# EAGLE design kaimat (EAGLE 9.3.0)
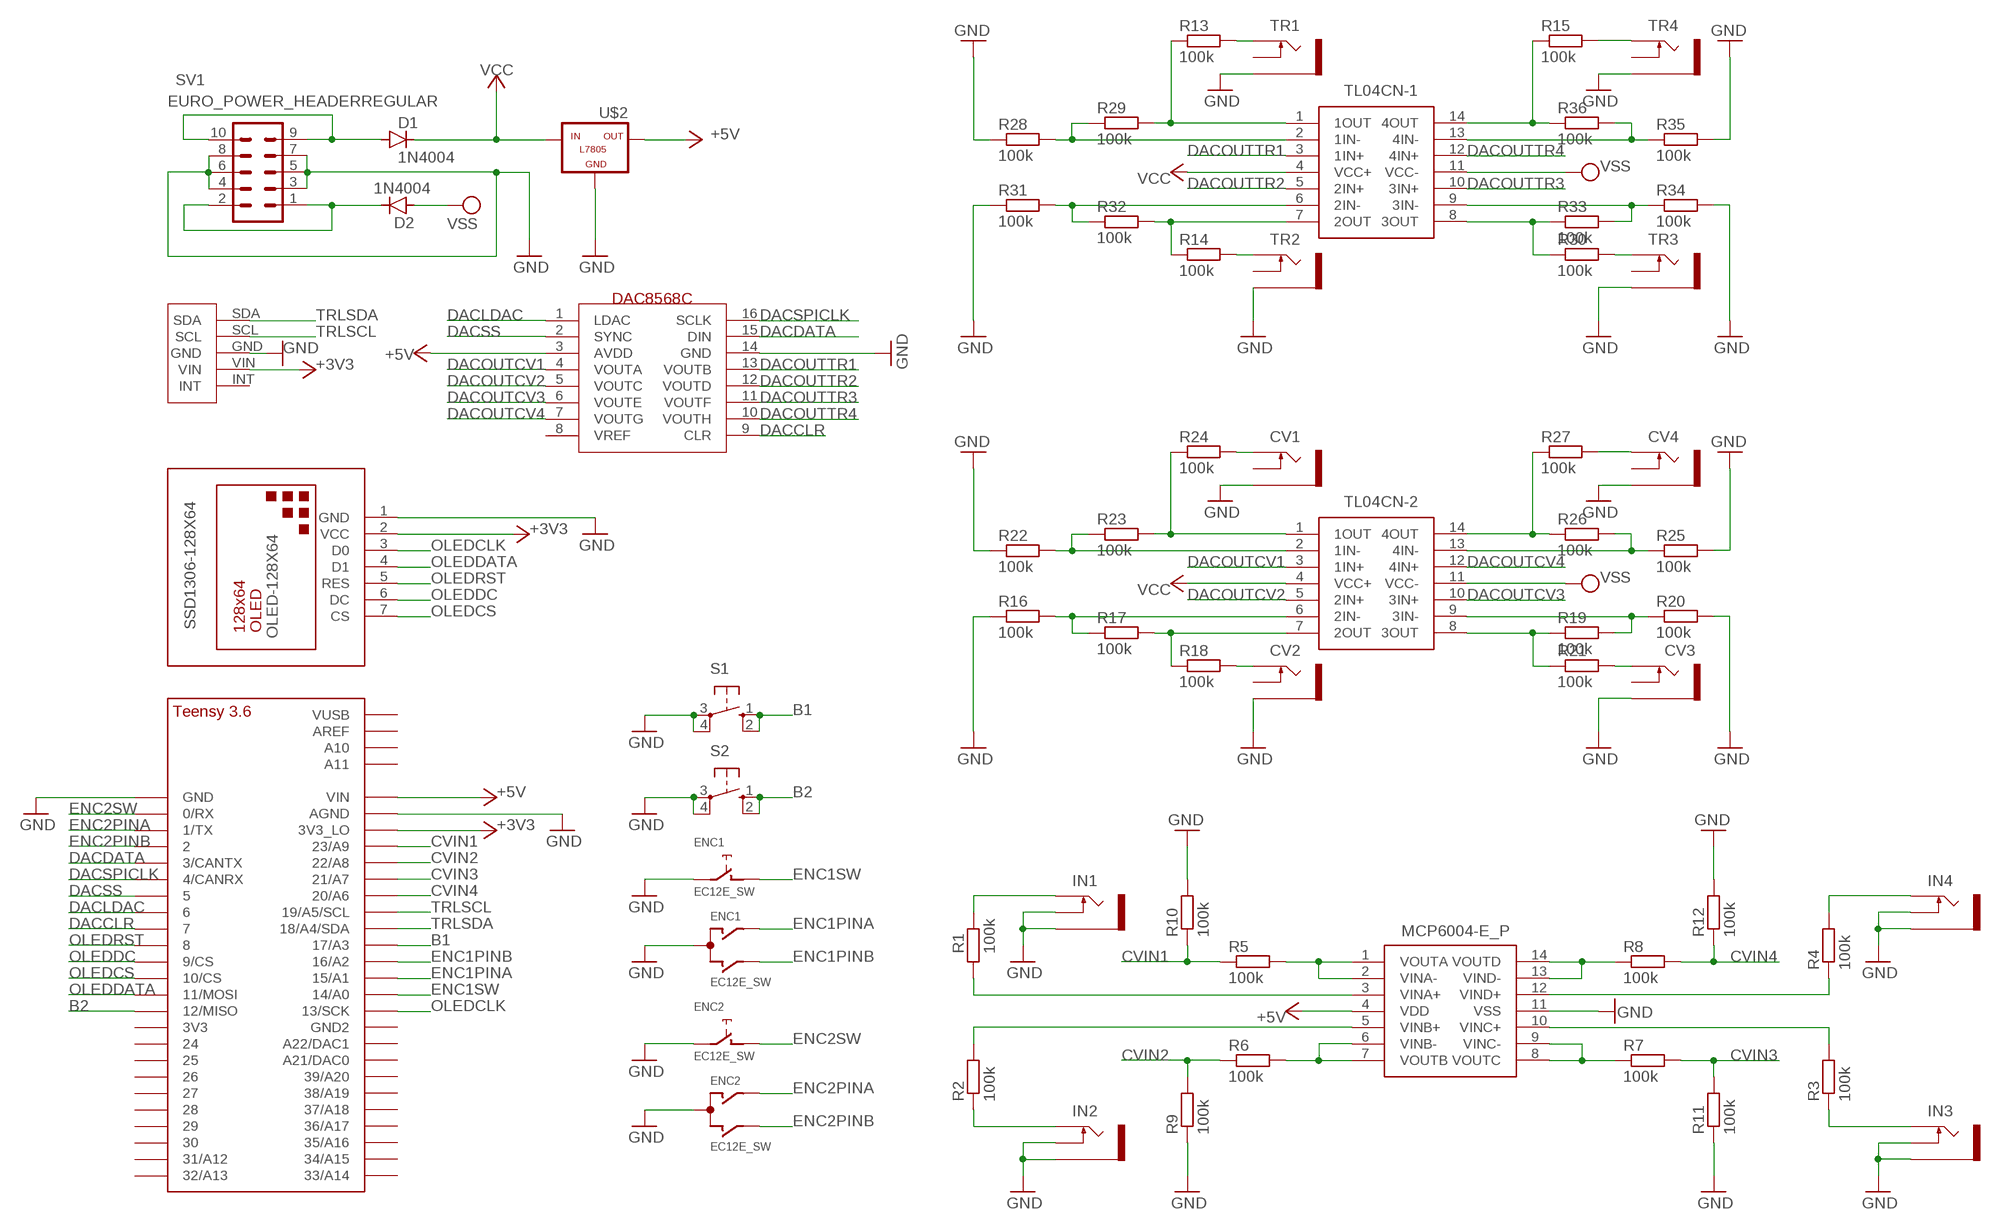
[diagram p0: schematic, sheet 1]

## Parts
CV1  THONKICONNNEW  [WQP-PJ301M-12_JACK]
CV2  THONKICONNNEW  [WQP-PJ301M-12_JACK]
CV3  THONKICONNNEW  [WQP-PJ301M-12_JACK]
CV4  THONKICONNNEW  [WQP-PJ301M-12_JACK]
D1  1N4004  [DO41-10]
D2  1N4004  [DO41-10]
DAC8568C  DAC8568C  [TSSOP16]
ENC1  EC12E_SW  [ALPS_EC12E_SW]
ENC2  EC12E_SW  [ALPS_EC12E_SW]
IN1  THONKICONNNEW  [WQP-PJ301M-12_JACK]
IN2  THONKICONNNEW  [WQP-PJ301M-12_JACK]
IN3  THONKICONNNEW  [WQP-PJ301M-12_JACK]
IN4  THONKICONNNEW  [WQP-PJ301M-12_JACK]
MCP6004-E_P  MCP6004-E_P  [DIP781W56P254L1918H533Q14N]
R1  100k  R-EU_R0805  [R0805]
R2  100k  R-EU_R0805  [R0805]
R3  100k  R-EU_R0805  [R0805]
R4  100k  R-EU_R0805  [R0805]
R5  100k  R-EU_R0805  [R0805]
R6  100k  R-EU_R0805  [R0805]
R7  100k  R-EU_R0805  [R0805]
R8  100k  R-EU_R0805  [R0805]
R9  100k  R-EU_R0805  [R0805]
R10  100k  R-EU_R0805  [R0805]
R11  100k  R-EU_R0805  [R0805]
R12  100k  R-EU_R0805  [R0805]
R13  100k  R-EU_R0805  [R0805]
R14  100k  R-EU_R0805  [R0805]
R15  100k  R-EU_R0805  [R0805]
R16  100k  R-EU_R0805  [R0805]
R17  100k  R-EU_R0805  [R0805]
R18  100k  R-EU_R0805  [R0805]
R19  100k  R-EU_R0805  [R0805]
R20  100k  R-EU_R0805  [R0805]
R21  100k  R-EU_R0805  [R0805]
R22  100k  R-EU_R0805  [R0805]
R23  100k  R-EU_R0805  [R0805]
R24  100k  R-EU_R0805  [R0805]
R25  100k  R-EU_R0805  [R0805]
R26  100k  R-EU_R0805  [R0805]
R27  100k  R-EU_R0805  [R0805]
R28  100k  R-EU_R0805  [R0805]
R29  100k  R-EU_R0805  [R0805]
R30  100k  R-EU_R0805  [R0805]
R31  100k  R-EU_R0805  [R0805]
R32  100k  R-EU_R0805  [R0805]
R33  100k  R-EU_R0805  [R0805]
R34  100k  R-EU_R0805  [R0805]
R35  100k  R-EU_R0805  [R0805]
R36  100k  R-EU_R0805  [R0805]
S1  10-XX  [B3F-10XX]
S2  10-XX  [B3F-10XX]
SSD1306-128X64  OLED-128X64  [DISPLAY-OLED-128X64-SMALL]
SV1  EURO_POWER_HEADERREGULAR  [EURO_POWER_HEADER]
TL04CN-1  TL074CN  [DIP794W53P254L1930H508Q14N]
TL04CN-2  TL074CN  [DIP794W53P254L1930H508Q14N]
TR1  THONKICONNNEW  [WQP-PJ301M-12_JACK]
TR2  THONKICONNNEW  [WQP-PJ301M-12_JACK]
TR3  THONKICONNNEW  [WQP-PJ301M-12_JACK]
TR4  THONKICONNNEW  [WQP-PJ301M-12_JACK]
U$1  TEENSY_3.5/3.6_BASIC  [TEENSY_3.5/3.6_BASIC]
U$2  -L7805  [L7805]
U$4  NEOTRELLISKAIMAT2  [NEOTRELLISKAIMAT2]

## Nets
+3V3: SSD1306-128X64.2(VCC) U$1.3V3_LO U$4.VIN
+5V: DAC8568C.3(AVDD) MCP6004-E_P.4(VDD) U$1.VIN U$2.OUT
B1: S1.1(S) S1.2(S1) U$1.17/A3
B2: S2.1(S) S2.2(S1) U$1.12/MISO
CVIN1: R5.1 R10.1 U$1.23/A9
CVIN2: R6.1 R9.2 U$1.22/A8
CVIN3: R7.2 R11.2 U$1.21/A7
CVIN4: R8.2 R12.1 U$1.20/A6
DACCLR: DAC8568C.9(CLR) U$1.7
DACDATA: DAC8568C.15(DIN) U$1.3/CANTX
DACLDAC: DAC8568C.1(LDAC) U$1.6
DACOUTCV1: DAC8568C.4(VOUTA) TL04CN-2.3(1IN+)
DACOUTCV2: DAC8568C.5(VOUTC) TL04CN-2.5(2IN+)
DACOUTCV3: DAC8568C.6(VOUTE) TL04CN-2.10(3IN+)
DACOUTCV4: DAC8568C.7(VOUTG) TL04CN-2.12(4IN+)
DACOUTTR1: DAC8568C.13(VOUTB) TL04CN-1.3(1IN+)
DACOUTTR2: DAC8568C.12(VOUTD) TL04CN-1.5(2IN+)
DACOUTTR3: DAC8568C.11(VOUTF) TL04CN-1.10(3IN+)
DACOUTTR4: DAC8568C.10(VOUTH) TL04CN-1.12(4IN+)
DACSPICLK: DAC8568C.16(SCLK) U$1.4/CANRX
DACSS: DAC8568C.2(SYNC) U$1.5
ENC1PINA: ENC1.A U$1.15/A1
ENC1PINB: ENC1.B U$1.16/A2
ENC1SW: ENC1.D U$1.14/A0
ENC2PINA: ENC2.A U$1.1/TX
ENC2PINB: ENC2.B U$1.2
ENC2SW: ENC2.D U$1.0/RX
GND: CV1.P$3_SLEEVE(SLEEVE) CV2.P$3_SLEEVE(SLEEVE) CV3.P$3_SLEEVE(SLEEVE) CV4.P$3_SLEEVE(SLEEVE) DAC8568C.14(GND) ENC1.C ENC1.E ENC2.C ENC2.E IN1.P$2_SWITCH(SWITCH) IN1.P$3_SLEEVE(SLEEVE) IN2.P$2_SWITCH(SWITCH) IN2.P$3_SLEEVE(SLEEVE) IN3.P$2_SWITCH(SWITCH) IN3.P$3_SLEEVE(SLEEVE) IN4.P$2_SWITCH(SWITCH) IN4.P$3_SLEEVE(SLEEVE) MCP6004-E_P.11(VSS) R9.1 R10.2 R11.1 R12.2 R16.1 R20.2 R22.1 R25.2 R28.1 R31.1 R34.2 R35.2 S1.3(P) S1.4(P1) S2.3(P) S2.4(P1) SSD1306-128X64.1(GND) SV1.3 SV1.4 SV1.5 SV1.6 SV1.7 SV1.8 TR1.P$3_SLEEVE(SLEEVE) TR2.P$3_SLEEVE(SLEEVE) TR3.P$3_SLEEVE(SLEEVE) TR4.P$3_SLEEVE(SLEEVE) U$1.AGND U$1.GND U$2.GND U$4.GND
N$1: D1.A SV1.9 SV1.10
N$2: R17.2 R18.1 TL04CN-2.7(2OUT)
N$3: IN1.P$1_TIP(TIP) R1.2
N$4: MCP6004-E_P.6(VINB-) MCP6004-E_P.7(VOUTB) R6.2
N$5: IN2.P$1_TIP(TIP) R2.1
N$6: IN3.P$1_TIP(TIP) R3.1
N$7: R14.1 R32.2 TL04CN-1.7(2OUT)
N$9: IN4.P$1_TIP(TIP) R4.2
N$11: MCP6004-E_P.5(VINB+) R2.2
N$12: MCP6004-E_P.13(VIND-) MCP6004-E_P.14(VOUTD) R8.1
N$13: MCP6004-E_P.8(VOUTC) MCP6004-E_P.9(VINC-) R7.1
N$14: MCP6004-E_P.3(VINA+) R1.1
N$15: MCP6004-E_P.10(VINC+) R3.2
N$16: MCP6004-E_P.12(VIND+) R4.1
N$17: R16.2 R17.1 TL04CN-2.6(2IN-)
N$18: MCP6004-E_P.1(VOUTA) MCP6004-E_P.2(VINA-) R5.2
N$19: CV2.P$1_TIP(TIP) R18.2
N$20: CV3.P$1_TIP(TIP) R21.2
N$21: R19.1 R21.1 TL04CN-2.8(3OUT)
N$22: R19.2 R20.1 TL04CN-2.9(3IN-)
N$23: R22.2 R23.1 TL04CN-2.2(1IN-)
N$24: R23.2 R24.1 TL04CN-2.1(1OUT)
N$25: CV1.P$1_TIP(TIP) R24.2
N$26: R25.1 R26.2 TL04CN-2.13(4IN-)
N$27: R26.1 R27.1 TL04CN-2.14(4OUT)
N$28: CV4.P$1_TIP(TIP) R27.2
N$29: D2.C SV1.1 SV1.2
N$30: R28.2 R29.1 TL04CN-1.2(1IN-)
N$31: R13.1 R29.2 TL04CN-1.1(1OUT)
N$32: R31.2 R32.1 TL04CN-1.6(2IN-)
N$33: R13.2 TR1.P$1_TIP(TIP)
N$34: R14.2 TR2.P$1_TIP(TIP)
N$35: R33.2 R34.1 TL04CN-1.9(3IN-)
N$36: R30.2 TR3.P$1_TIP(TIP)
N$37: R30.1 R33.1 TL04CN-1.8(3OUT)
N$38: R35.1 R36.2 TL04CN-1.13(4IN-)
N$39: R15.1 R36.1 TL04CN-1.14(4OUT)
N$40: R15.2 TR4.P$1_TIP(TIP)
OLEDCLK: SSD1306-128X64.3(D0) U$1.13/SCK
OLEDCS: SSD1306-128X64.7(CS) U$1.10/CS
OLEDDATA: SSD1306-128X64.4(D1) U$1.11/MOSI
OLEDDC: SSD1306-128X64.6(DC) U$1.9/CS
OLEDRST: SSD1306-128X64.5(RES) U$1.8
TRLSCL: U$1.19/A5/SCL U$4.SCL
TRLSDA: U$1.18/A4/SDA U$4.SDA
VCC: D1.C TL04CN-1.4(VCC+) TL04CN-2.4(VCC+) U$2.IN
VSS: D2.A TL04CN-1.11(VCC-) TL04CN-2.11(VCC-)
Unconnected: CV1.P$2_SWITCH(SWITCH) CV2.P$2_SWITCH(SWITCH) CV3.P$2_SWITCH(SWITCH) CV4.P$2_SWITCH(SWITCH) DAC8568C.8(VREF) ENC1.GND1(G) ENC1.GND2(G) ENC2.GND1(G) ENC2.GND2(G) TR1.P$2_SWITCH(SWITCH) TR2.P$2_SWITCH(SWITCH) TR3.P$2_SWITCH(SWITCH) TR4.P$2_SWITCH(SWITCH) U$1.3V3 U$1.21/DAC0(A21/DAC0) U$1.24 U$1.25 U$1.26 U$1.27 U$1.28 U$1.29 U$1.30 U$1.31/A12 U$1.32/A13 U$1.33/A14 U$1.34/A15 U$1.35/A16 U$1.36/A17 U$1.37/A18 U$1.38/A19 U$1.39/A20 U$1.A10 U$1.A11 U$1.A22/DAC1 U$1.AREF U$1.GND2 U$1.VUSB U$4.INT

## Library data of the parts
CV1-CV4 IN1-IN4 TR1-TR4 = MusicThingModular:THONKICONN: 3.5mm socket for Eurorack modular synths
D1 D2 = diode:1N4004: DIODE general purpose rectifier, 1 A
DAC8568C = analog-devices-3:DAC8568C
ENC1 ENC2 = switch-alps:EC12E_SW: ALPS rotary Encoder EC12E series with switch; MPN: EC12E2424407; OC_FARNELL: 1520813; OC_NEWARK: 74M1068
MCP6004-E_P = mcp6004-e_p:MCP6004-E_P: Microchip MCP6004-E/P Op Amp, 1MHz, 1.8 6 V Rail-Rail 0.6V/s Linear, 14-pin PDIP Source: Datasheet <http://docs-asia.electrocomponents.com/webdocs/1381/0900766b81381145.pdf>; DESCRIPTION: Microchip MCP6004-E/P Op Amp, 1MHz, 1.8 6 V Rail-Rail 0.6V/s Linear, 14-pin PDIP; HEIGHT: 5.334mm; MANUFACTURER_NAME: Microchip; MANUFACTURER_PART_NUMBER: mcp6004-e/p; MOUSER_PART_NUMBER: 579-MCP6004-E/P; MOUSER_PRICE-STOCK: https://www.mouser.com/Search/Refine.aspx?Keyword=579-MCP6004-E%2FP; RS_PART_NUMBER: 7386178P; RS_PRICE-STOCK: http://uk.rs-online.com/web/p/products/7386178P
R1-R36 = Clean-Kong:R-EU_: RESISTOR, European symbol
S1 S2 = switch-omron:10-XX: OMRON SWITCH; MPN: B3F-1000; OC_FARNELL: 176432; OC_NEWARK: 36M3542
SSD1306-128X64 = diy-modules:OLED-128X64
SV1 = MusicThingModular:EURO_POWER_HEADER: Power Header 10 pin power header for Eurorack Power Supplies Variants with fatter pads for easier soldering, and the LOCK variant which has 5mil offset pins to hold the component in place before soldering
TL04CN-1 TL04CN-2 = TL074CN:TL074CN: Quad Low-Noise JFET-Input General-Purpose Operational Amplifier Source: Datasheet <http://uk.rs-online.com/web/p/products/0302621>; DESCRIPTION: Quad Low-Noise JFET-Input General-Purpose Operational Amplifier; HEIGHT: 5.08mm; MANUFACTURER_NAME: Texas Instruments; MANUFACTURER_PART_NUMBER: TL074CN; MOUSER_PART_NUMBER: 595-TL074CN; MOUSER_PRICE-STOCK: https://www.mouser.com/Search/Refine.aspx?Keyword=595-TL074CN; RS_PART_NUMBER: 0302621P; RS_PRICE-STOCK: http://uk.rs-online.com/web/p/products/0302621P
U$1 = Teensy356:TEENSY_3.5/3.6_BASIC; OC_FARNELL: unknown
U$2 = tango:-L7805
U$4 = Adafruit Trellis:NEOTRELLISKAIMAT2

## Net classes
1 power: width 0.406 mm

## Board
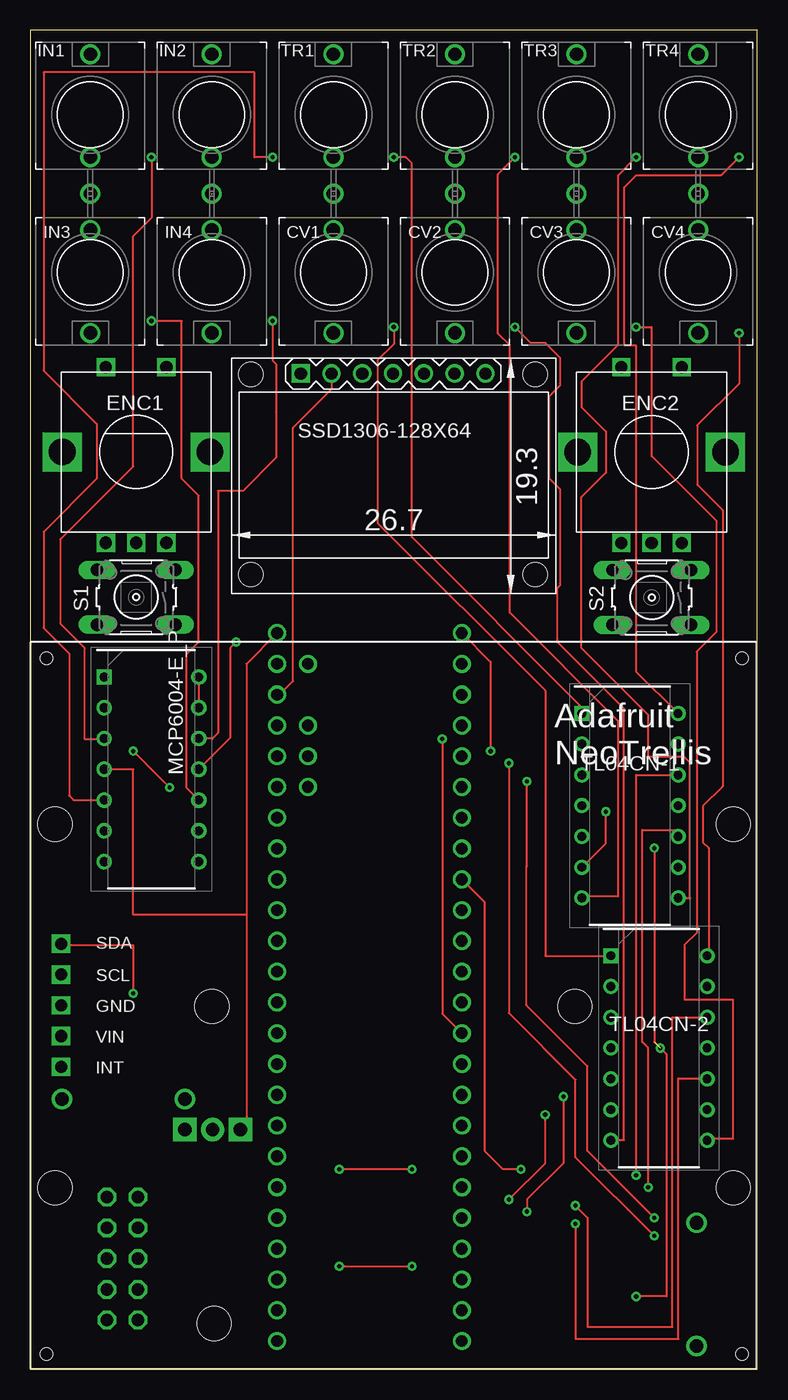
[diagram p1: board, top side]
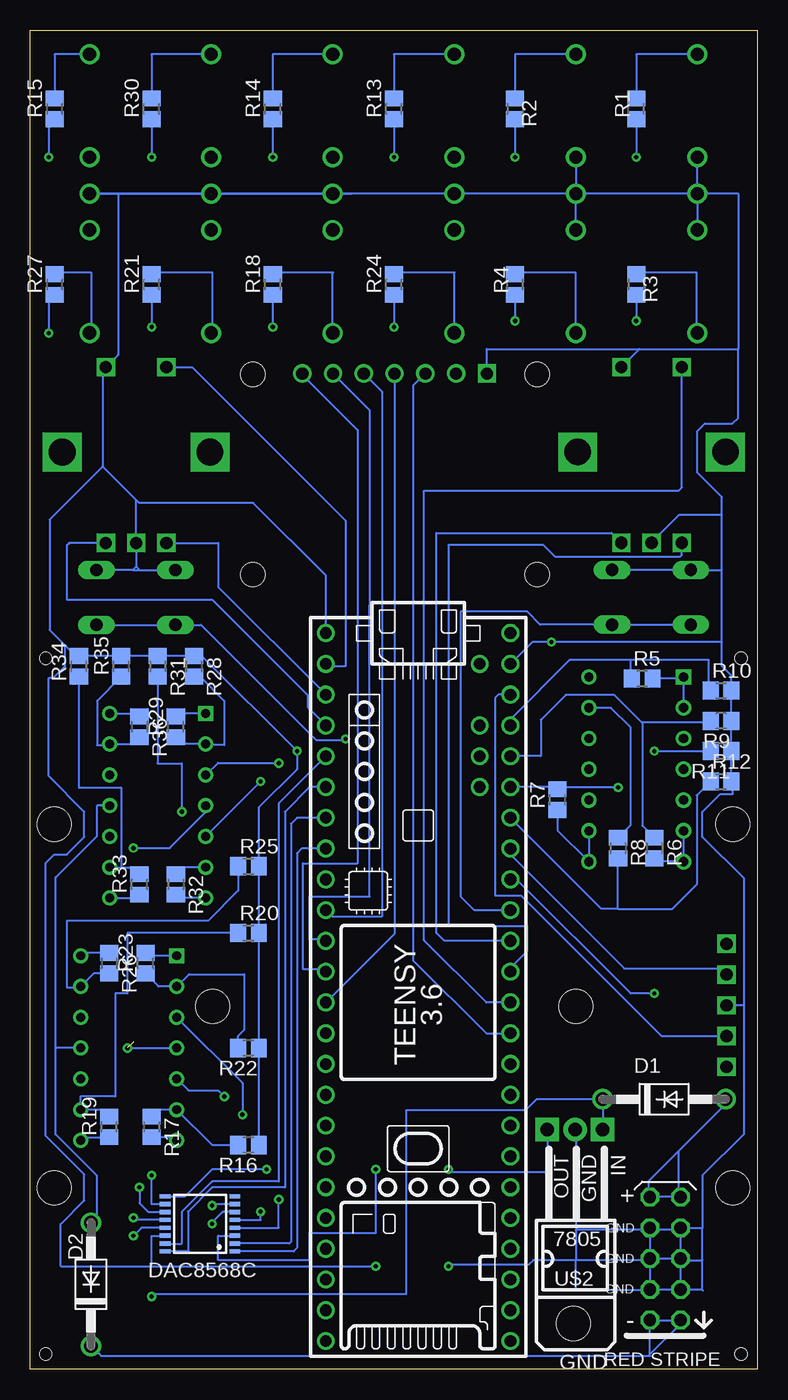
[diagram p2: board, bottom side, seen from below]

Size 60.01 x 110.48 mm. Coordinates in mm from the lower left corner, seen from the top.
Outline: 0,0 60.01,0 60.01,110.48 0,110.48 0,0
Copper layers (1*16): Top 0.035mm / dielectric 1.5mm / Bottom 0.035mm
Design rules "default": minimum track width 6mil, minimum drill 0.35mm, track to track 6mil, track to pad 6mil, pad to pad 6mil, via to via 6mil, smd to smd 6mil, copper to edge 40mil, drill to drill 6mil, minimum pad ring 10mil, minimum via ring 8mil, stop-mask expansion 4mil, vias tented up to drill 0mil, thermal gap 10mil

### Footprints (pad centres in the part's own frame; a part is rotated, then mirrored left to right if it is on the bottom)
WQP-PJ301M-12_JACK = drill 1.1: P$1_TIP 0,5; P$2_SWITCH 0,-3.5; P$3_SLEEVE 0,-6.5
DO41-10 = drill 1.118: A 5.08,0; C -5.08,0
TSSOP16 = smd 0.9 x 0.35: 1 -2.875,2.275; 2 -2.875,1.625; 3 -2.875,0.975; 4 -2.875,0.325; 5 -2.875,-0.325; 6 -2.875,-0.975; 7 -2.875,-1.625; 8 -2.875,-2.275; 9 2.875,-2.275; 10 2.875,-1.625; 11 2.875,-0.975; 12 2.875,-0.325; 13 2.875,0.325; 14 2.875,0.975; 15 2.875,1.625; 16 2.875,2.275
ALPS_EC12E_SW = drill 1 square: A -2.5,-7.5; B 2.5,-7.5; C 0,-7.5; D -2.5,7; E 2.5,7 | drill 2.2 square: GND1 -6.1,0; GND2 6.1,0
DIP781W56P254L1918H533Q14N = drill 0.759 pad 1.159 square: 1 -3.905,7.62 | drill 0.759 pad 1.159: 2 -3.905,5.08; 3 -3.905,2.54; 4 -3.905,0; 5 -3.905,-2.54; 6 -3.905,-5.08; 7 -3.905,-7.62; 8 3.905,-7.62; 9 3.905,-5.08; 10 3.905,-2.54; 11 3.905,0; 12 3.905,2.54; 13 3.905,5.08; 14 3.905,7.62
R0805 = smd 1.3 x 1.5: 1 -0.85,0; 2 0.85,0
B3F-10XX = drill 1.016 long: 1 -3.251,2.261; 2 3.251,2.261; 3 -3.251,-2.261; 4 3.251,-2.261
DISPLAY-OLED-128X64-SMALL = drill 1 square: 1 -6.985,7.62 | drill 1: 2 -4.445,7.62; 3 -1.905,7.62; 4 0.635,7.62; 5 3.175,7.62; 6 5.715,7.62; 7 8.255,7.62 | hole 2: -11.125,7.54; 12.351,7.54; 12.351,-8.97; -11.125,-8.97
EURO_POWER_HEADER = drill 1.016 octagon: 1 -5.08,-1.27; 2 -5.08,1.27; 3 -2.54,-1.27; 4 -2.54,1.27; 5 0,-1.27; 6 0,1.27; 7 2.54,-1.27; 8 2.54,1.27; 9 5.08,-1.27; 10 5.08,1.27
DIP794W53P254L1930H508Q14N = drill 0.73 pad 1.13 square: 1 -3.97,7.62 | drill 0.73 pad 1.13: 2 -3.97,5.08; 3 -3.97,2.54; 4 -3.97,0; 5 -3.97,-2.54; 6 -3.97,-5.08; 7 -3.97,-7.62; 8 3.97,-7.62; 9 3.97,-5.08; 10 3.97,-2.54; 11 3.97,0; 12 3.97,2.54; 13 3.97,5.08; 14 3.97,7.62
TEENSY_3.5/3.6_BASIC = drill 0.965: 0/RX -25.4,-7.62; 1/TX -22.86,-7.62; 2 -20.32,-7.62; 3/CANTX -17.78,-7.62; 3V3 7.62,-7.62; 3V3_LO -22.86,7.62; 4/CANRX -15.24,-7.62; 5 -12.7,-7.62; 6 -10.16,-7.62; 7 -7.62,-7.62; 8 -5.08,-7.62; 9/CS -2.54,-7.62; 10/CS 0,-7.62; 11/MOSI 2.54,-7.62; 12/MISO 5.08,-7.62; 13/SCK 5.08,7.62; 14/A0 2.54,7.62; 15/A1 0,7.62; 16/A2 -2.54,7.62; 17/A3 -5.08,7.62; 18/A4/SDA -7.62,7.62; 19/A5/SCL -10.16,7.62; 20/A6 -12.7,7.62; 21/A7 -15.24,7.62; 21/DAC0 12.7,7.62; 22/A8 -17.78,7.62; 23/A9 -20.32,7.62; 24 10.16,-7.62; 25 12.7,-7.62; 26 15.24,-7.62; 27 17.78,-7.62; 28 20.32,-7.62; 29 22.86,-7.62; 30 25.4,-7.62; 31/A12 27.94,-7.62; 32/A13 30.48,-7.62; 33/A14 30.48,7.62; 34/A15 27.94,7.62; 35/A16 25.4,7.62; 36/A17 22.86,7.62; 37/A18 20.32,7.62; 38/A19 17.78,7.62; 39/A20 15.24,7.62; A10 -17.78,5.08; A11 -15.24,5.08; A22/DAC1 10.16,7.62; AGND -25.4,7.62; AREF -20.32,5.08; GND -27.94,-7.62; GND2 7.62,7.62; VIN -27.94,7.62; VUSB -25.4,5.08
L7805 = drill 1.1 pad 1.93: GND 0.127,-9.652 | drill 1.1 pad 1.93 square: IN -2.159,-9.652; OUT 2.413,-9.652 | hole 2.8: 0.254,6.35
NEOTRELLISKAIMAT2 = drill 1 square: GND 2.54,-29.972; INT 2.54,-35.052; SCL 2.54,-27.432; SDA 2.54,-24.892; VIN 2.54,-32.512 | hole 2.8: 2.035,-15.036; 58.035,-15.036; 2.035,-45.035; 58.035,-45.035; 14.989,-30.049; 44.962,-30.049 | hole 1: 1.335,-1.335; 58.736,-1.335; 1.335,-58.736; 58.736,-58.736

### Placement (x,y rotation side)
CV1  25.02,90.5 180 top
CV2  35.05,90.5 180 top
CV3  45.09,90.5 180 top
CV4  55.12,90.5 180 top
D1  7.69,22.27 0 bottom
D2  55,7 90 bottom
DAC8568C  46,12 180 bottom
ENC1  8.73,75.69 0 top
ENC2  51.28,75.68 0 top
IN1  4.95,103.5 0 top
IN2  14.99,103.5 0 top
IN3  4.95,90.5 180 top
IN4  14.99,90.5 180 top
MCP6004-E_P  10,49.5 0 top
R1  10,104 90 bottom
R2  20,104 270 bottom
R3  10,89.5 270 bottom
R4  20,89.5 90 bottom
R5  9.5,57 0 bottom
R6  8.5,43 270 bottom
R7  16.5,47 90 bottom
R8  11.5,43 270 bottom
R9  3,53.5 180 bottom
R10  3,56 0 bottom
R11  3,51 180 bottom
R12  3,48.5 0 bottom
R13  30,104 90 bottom
R14  40,104 90 bottom
R15  58,104 90 bottom
R16  42,18.5 180 bottom
R17  50,20 270 bottom
R18  40,89.5 90 bottom
R19  53.5,20 90 bottom
R20  42,36 0 bottom
R21  50,89.5 90 bottom
R22  42,26.5 180 bottom
R23  50.5,33.5 90 bottom
R24  30,89.5 90 bottom
R25  42,41.5 0 bottom
R26  53.5,33.5 270 bottom
R27  58,89.5 90 bottom
R28  46.5,58 270 bottom
R29  48,53 90 bottom
R30  50,104 90 bottom
R31  49.5,58 270 bottom
R32  48,40 270 bottom
R33  51,40 90 bottom
R34  56,58 90 bottom
R35  52.5,58 90 bottom
R36  51,53 270 bottom
S1  8.74,63.7 180 top
S2  51.29,63.68 180 top
SSD1306-128X64  29.31,74.54 0 top
SV1  7.6,9.12 90 bottom
TL04CN-1  49.5,46.5 0 top
TL04CN-2  51.89,26.5 0 top
TR1  25.02,103.5 0 top
TR2  35.05,103.5 0 top
TR3  45.09,103.5 0 top
TR4  55.12,103.5 0 top
U$1  28,32.8 270 bottom
U$2  14.93,10.12 180 bottom
U$4  0,60 0 top

### Tracks (layer width: path | path; a pad name or v marks a point on that pad's centre or on a via)
+3V3
  Top 0.152: SSD1306-128X64.2 24.86,80.86 21.69,77.69 21.69,56.78 20.57,55.66 U$1.3V3_LO
  Bottom 0.152: U$4.VIN 7.92,27.49 19.51,39.08 21.64,39.08 21.64,55.4 21.38,55.66 U$1.3V3_LO
+5V  (via drill 0.35)
  Top 0.152: 17.84,37.5 17.84,58.2 U$1.VIN | 17.84,37.5 17.84,20.27 U$2.OUT | v31.5,16.5 v25.5,16.5 | 17.84,37.5 8.5,37.5 8.5,49.5 MCP6004-E_P.4
  Bottom 0.152: U$2.OUT 17.34,16.3 25.3,16.3 v25.5,16.5 | v31.5,16.5 31.5,11.22 37,11.22 37,9 44.5,9 44.5,11.03 DAC8568C.3
B1
  Bottom 0.152: S1.2 S1.1 17.94,61.44 19,62.5 24.5,62.5 24.5,39 23.38,37.88 U$1.17/A3
B2  (via drill 0.35)
  Top 0.152: v34,52 34,29.34 U$1.12/MISO
  Bottom 0.152: S2.1 S2.2 45.92,61.42 36.41,51.91 34.09,51.91 v34,52
CVIN1
  Bottom 0.152: U$1.23/A9 20.38,53.62 15.5,58.5 10.5,58.5 | R10.1 4,56.15 4,58.5 10.5,58.5 | 10.5,58.5 10.5,57 R5.1
CVIN2
  Bottom 0.152: U$1.22/A8 17.88,50.58 17.88,53.58 15.82,55.63 11.81,55.63 9.59,53.41 | R6.1 9.5,44.85 9.5,53.33 9.59,53.41 | 9.59,53.41 3.94,53.41 R9.2
CVIN3  (via drill 0.35)
  Top 0.152: v8.5,51 v11.5,48
  Bottom 0.152: R7.2 16.32,47.67 16.07,47.92 | 16.07,47.92 16.19,48.04 U$1.21/A7 | v11.5,48 16,48 16.07,47.92 | v8.5,51 R11.2
CVIN4
  Bottom 0.152: R12.1 5,47.35 5,40 7,38 11.5,38 | 11.5,38 12.88,38 U$1.20/A6 | 11.5,38 R8.2
DACCLR  (via drill 0.35)
  Top 0.152: U$1.7 37.5,38.54 37.5,18 39,16.5 v40.5,16.5
  Bottom 0.152: DAC8568C.9 47.23,14.28 45,16.5 v40.5,16.5
DACDATA
  Bottom 0.152: U$1.3/CANTX 39.5,46.7 39.5,15.5 45,15.5 47.5,13 47.5,10.35 48.85,10.35 DAC8568C.15
DACLDAC
  Bottom 0.152: U$1.6 37.62,42.96 38,42.58 38,10 38.27,9.72 DAC8568C.1
DACOUTCV1  (via drill 0.35)
  Top 0.152: v39.5,14 42.5,17 v42.5,21
  Bottom 0.152: DAC8568C.4 39.5,11.68 v39.5,14 | v42.5,21 42.5,23.62 TL04CN-2.3
DACOUTCV2  (via drill 0.35)
  Top 0.152: v41,13 41,14 44,17 v44,22.5
  Bottom 0.152: DAC8568C.5 41,12.32 v41,13 | v44,22.5 44.5,23 46.96,23 TL04CN-2.5
DACOUTCV3  (via drill 0.35)
  Top 0.152: v45,12 45,2.5 53.5,2.5 53.5,24 55.82,24 TL04CN-2.10
  Bottom 0.152: DAC8568C.6 44.12,12.97 45,12.1 v45,12
DACOUTCV4  (via drill 0.35)
  Top 0.152: v45,13.5 46,12.5 46,3.5 53,3.5 53,29.04 TL04CN-2.12
  Bottom 0.152: DAC8568C.7 44.88,13.62 v45,13.5
DACOUTTR1  (via drill 0.35)
  Top 0.152: v51.5,11 45,17.5 45,23.89 39.5,29.39 v39.5,50
  Bottom 0.152: DAC8568C.13 50.83,11.68 v51.5,11 | v39.5,50 39.54,50.04 44.53,50.04 TL04CN-1.3
DACOUTTR2  (via drill 0.35)
  Top 0.152: v51.5,12.5 46,18 46,25 40.97,30.03 40.97,41.47 41,41.5 v41,48.5
  Bottom 0.152: DAC8568C.12 51.33,12.32 v51.5,12.5 | v41,48.5 v41,48.49 TL04CN-1.5
DACOUTTR3  (via drill 0.35)
  Top 0.152: v51,15 51,26.5 50.5,27 50.5,44.5 53.5,44.5 53.5,43.99 TL04CN-1.10
  Bottom 0.152: v51,15 v50.99,14.99 50.99,13.69 50.28,12.97 DAC8568C.11
DACOUTTR4  (via drill 0.35)
  Top 0.152: v50,16 50,49.04 TL04CN-1.12
  Bottom 0.152: DAC8568C.10 50,13.62 v50,16
DACSPICLK
  Bottom 0.152: U$1.4/CANRX 36.96,48.04 39,46 39,15 45,15 47,13 47,9.71 48.86,9.71 DAC8568C.16
DACSS
  Bottom 0.152: U$1.5 38,45.5 38.5,45 38.5,10.5 38.62,10.38 DAC8568C.2
ENC1PINA
  Bottom 0.152: U$1.15/A1 20.38,33.12 19,34.5 19,36.58 25.5,36.58 25.5,68 17.66,68 16.73,67.07 6.36,67.07 6.24,67.19 ENC1.A
ENC1PINB
  Bottom 0.152: U$1.16/A2 25.84,35.34 26.5,36 26.5,69 12.04,69 ENC1.B
ENC1SW
  Bottom 0.152: U$1.14/A0 22.38,30.26 27.5,35.38 27.5,72.5 6.5,72.5 6.24,72.77 ENC1.D
ENC2PINA
  Bottom 0.152: ENC2.A 44.5,68.18 44.5,64.55 U$1.1/TX
ENC2PINB
  Bottom 0.152: ENC2.B 56.82,68.18 57,68 57,63.5 45,63.5 37.12,55.62 37.12,54.63 U$1.2
ENC2SW
  Bottom 0.152: ENC2.D 46.64,82.68 34,70.04 34,58 35.41,58 U$1.0/RX
GND  (via drill 0.35)  (5 unrouted)
  Top 0.152: 35.36,61 U$1.GND 38,58.36 v38,51 | v25.5,8.5 v31.5,8.5 | MCP6004-E_P.11 16.5,52.09 16.5,59.5 v17,60
  Bottom 0.152: 8.87,11.5 SV1.8 9.04,11.5 | 8.87,11.5 8.87,9 | SV1.4 SV1.3 | SV1.3 SV1.7 | SV1.7 6.5,11.5 8.87,11.5 | SV1.7 4.53,11.66 | 1.09,30 1.09,19.43 4.53,16 4.53,11.66 | 1.09,30 2.51,30 U$4.GND | 1.09,30 1.09,40.5 4.53,43.93 4.53,46 3.07,47.46 2.04,47.46 | 2.04,47.46 2,47.5 | 2.93,60 2.93,58.01 2.15,57.23 R10.2 R9.1 R11.1 R12.2 2.04,48.39 2.04,47.46 | 2.93,60 2.93,66 | 2.93,66 2.93,70.5 | 2.93,70.5 2.93,71.94 4.97,73.99 4.97,77.39 4.34,78.03 2.06,78.03 1.59,78.5 1.59,84.17 | 1.59,84.17 1.59,97 5.5,97 | 5.5,97 IN1.P$3_SLEEVE | IN1.P$3_SLEEVE IN1.P$2_SWITCH | IN1.P$3_SLEEVE IN3.P$2_SWITCH | IN1.P$3_SLEEVE 14,97 IN4.P$3_SLEEVE | IN4.P$3_SLEEVE 33.51,97 | 35.5,97 TR3.P$3_SLEEVE 45.5,97 | 45.5,97 52.78,97 | 52.78,97 TR4.P$3_SLEEVE | TR4.P$3_SLEEVE | IN2.P$2_SWITCH IN4.P$3_SLEEVE | IN4.P$2_SWITCH 15,94.01 IN4.P$3_SLEEVE | 2.93,66 2.97,65.96 S1.4 S1.3 | S1.3 12,65.46 | U$2.GND 15,19.72 15,11.5 | 8.87,11.5 9.04,11.5 | 9.04,11.5 15,11.5 | 52.78,97 52.78,83.68 ENC2.E 54.04,82.42 54.04,74.5 | ENC2.C 51.28,66.22 51.56,65.94 | 51.56,65.94 S2.3 | 51.56,65.94 51,65.94 | 51,65.94 S2.4 | ENC2.C 51.28,66.22 51,65.94 | SSD1306-128X64.1 22.32,84.17 9.75,84.17 | 9.75,84.17 1.59,84.17 | ENC1.E 9.75,84.17 | ENC1.C 6.43,70.5 2.93,70.5 | 15,11.5 15,9 | 8.87,9 15,9 | 50,8.5 v31.5,8.5 | 50,8.5 50,11 48.9,11 DAC8568C.14 48.85,11 | R16.1 R22.1 R20.2 R25.2 41.15,46.35 38,49.5 v38,51 45.85,58.85 R28.1 R31.1 R35.2 R34.2 56.27,58.85 57.14,59.72 | 2.93,60 v17,60 18.58,60 U$1.AGND | 12.04,66 S1.3 | IN4.P$3_SLEEVE | TR1.P$3_SLEEVE 35.49,97 35.5,97 | TR2.P$3_SLEEVE 45.49,97 45.5,97 | 54.04,74.5 54.04,74.48 58.42,70.1 58.42,61 57.14,59.72 | 50,8.5 57.5,8.5 57.5,11.97 55.54,13.93 55.54,16.07 58.73,19.25 58.73,41.77 58.03,42.47 57,42.47 55.54,43.93 55.54,46 58.5,48.95 58.5,57 58.43,57.07 58.08,57.07 57.14,58.01 57.14,59.72
  Bottom 0.152: 8.87,9 8.75,9.12 SV1.5 6.21,9 4.53,9 | SV1.6 SV1.4 | SV1.4 8.96,6.5 15,6.5 15,9 | SV1.3 4.58,6.58 4.53,6.53 | 4.5,6.5 4.53,6.53 | 4.53,6.53 4.53,9 | 4.53,9 4.53,11.66 | ENC2.C 51.28,71.74 | 51.28,71.74 51.02,71.48 41.61,71.48 35.62,65.48 U$1.GND | 51.28,71.74 54.04,74.5 | TR4.P$3_SLEEVE | 15,9 18.5,9 18.85,8.65 25.35,8.65 v25.5,8.5 | 5.5,97 16.5,97 | 16.5,97 33.5,97 | 33.5,97 35,97 | 35,97 35.5,97 | 35.5,97 55.11,97 TR4.P$3_SLEEVE | TR2.P$3_SLEEVE 35,97 | 35,97 | TR2.P$3_SLEEVE 35.5,97 | 35.5,97 | 35.5,97 33.51,97 | 33.51,97 33.5,97 | IN4.P$3_SLEEVE 16.5,97
N$1
  Bottom 0.152: 6.5,18 9,15.5 9,14.33 SV1.10 SV1.9 6.5,14.37 6.5,18 | 6.5,18 2.61,21.89 D1.A
N$2  (via drill 0.35)
  Top 0.152: v40,86 41.33,84.67 42.53,84.67 43.75,83.45 43.75,81.21 42.84,80.3 42.84,73.48 43.75,72.57 43.75,64.7 43.5,64.45 43.5,60 49,54.5 49,18.9 47.94,18.9 TL04CN-2.7
  Bottom 0.152: R17.2 48.19,19.15 TL04CN-2.7 | R18.1 v40,86
N$3
  Bottom 0.152: IN1.P$1_TIP 9.99,108.5 10,108.5 R1.2
N$4
  Bottom 0.152: MCP6004-E_P.6 MCP6004-E_P.7 7.88,41.88 8.15,42.15 R6.2
N$5
  Bottom 0.152: IN2.P$1_TIP 20,108.5 R2.1
N$6
  Bottom 0.152: IN3.P$1_TIP 5,85.55 5,90.5 9.85,90.5 R3.1
N$7  (via drill 0.35)
  Top 0.152: v40,100 38.61,98.61 38.61,85.46 39.57,84.5 39.57,62.43 48.5,53.5 48.5,39 45.65,39 TL04CN-1.7
  Bottom 0.152: TL04CN-1.7 47.73,38.88 R32.2 | R14.1 v40,100
N$9
  Bottom 0.152: IN4.P$1_TIP 15,85.51 15,90.5 19.85,90.5 R4.2
N$11  (via drill 0.35)
  Top 0.152: v20,100 18.5,100 18.5,107 1.09,107 1.09,82.41 5.5,78 5.5,73.5 1.09,69.09 1.09,61.16 3.19,59.06 3.19,47.33 3.56,46.96 MCP6004-E_P.5
  Bottom 0.152: R2.2 v20,100
N$12
  Top 0.152: MCP6004-E_P.14 MCP6004-E_P.13
  Bottom 0.152: R8.1 10.5,44.85 10.5,53 12.08,54.58 MCP6004-E_P.13
N$13
  Bottom 0.152: MCP6004-E_P.9 MCP6004-E_P.8 16.5,44.48 R7.1
N$14  (via drill 0.35)
  Top 0.152: v10,100 10,95 8.5,93.5 8.5,74.5 2.5,68.5 2.5,61.5 4.5,59.5 4.5,52 6.05,52 MCP6004-E_P.3
  Bottom 0.152: R1.1 v10,100
N$15  (via drill 0.35)
  Top 0.152: v10,86.5 12.5,86.5 12.5,73.49 13.9,72.08 13.9,60 12.9,59 12.9,47.96 MCP6004-E_P.10
  Bottom 0.152: R3.2 v10,86.5
N$16  (via drill 0.35)
  Top 0.152: v20,86.5 20,83.22 20.28,82.95 20.28,79 20.28,75.2 17.55,72.48 15.5,72.48 15.5,52.5 15.04,52.04 MCP6004-E_P.12
  Bottom 0.152: R4.1 v20,86.5
N$17
  Bottom 0.152: R17.1 49.43,21.42 TL04CN-2.6 45,18.5 R16.2
N$18
  Bottom 0.152: MCP6004-E_P.2 MCP6004-E_P.1 6.21,57 R5.2
N$19
  Bottom 0.152: CV2.P$1_TIP 35.05,90.45 35,90.5 39.85,90.5 R18.2
N$20
  Bottom 0.152: CV3.P$1_TIP 45,85.58 45,90.5 49.85,90.5 R21.2
N$21  (via drill 0.35)
  Top 0.152: v50,86 51.3,86 51.3,75.34 56.64,70 56.64,60.86 55,59.21 55,36 54,35 54,30.5 58,30.5 58,19 55.98,19 TL04CN-2.8
  Bottom 0.152: TL04CN-2.8 55.59,19.15 R19.1 | R21.1 v50,86
N$22
  Bottom 0.152: R19.2 54.07,21.42 TL04CN-2.9 55.86,22.5 53,22.5 53,31 52,31 52,36 R20.1
N$23
  Bottom 0.152: R22.2 42.85,27.5 42.35,28 42.35,32.58 46.92,32.58 TL04CN-2.2 49.43,31.58 R23.1
N$24  (via drill 0.35)
  Top 0.152: v30,86 30,84.61 28.66,83.27 28.66,69.84 42.5,56 42.5,34.12 TL04CN-2.1
  Bottom 0.152: TL04CN-2.1 50.27,34.12 R23.2 | R24.1 v30,86
N$25
  Bottom 0.152: CV1.P$1_TIP 25.02,90.48 25,90.5 29.85,90.5 R24.2
N$26
  Bottom 0.152: R26.2 54.79,32.65 TL04CN-2.13 55.94,31.5 57,31.5 57,37 45.35,37 42.85,39.5 R25.1
N$27  (via drill 0.35)
  Top 0.152: v58.5,85.5 58.5,81.34 55.04,77.89 55.04,72.98 57.14,70.88 57.14,48.1 55.52,46.48 55.52,43.48 56,43 56,34.26 TL04CN-2.14
  Bottom 0.152: R26.1 55.63,34.35 TL04CN-2.14 | R27.1 58.5,88.15 v58.5,85.5
N$28
  Bottom 0.152: CV4.P$1_TIP 55,85.62 55,90.5 57.85,90.5 R27.2
N$29
  Bottom 0.152: D2.C 54.17,1.09 9,1.09 | 9,1.09 8.87,1.09 SV1.2 SV1.1 6.33,3.76 9,1.09
N$30
  Bottom 0.152: R29.1 47.43,51.58 TL04CN-1.2 45.45,51.5 44,51.5 44,55.15 46,57.15 R28.2
N$31  (via drill 0.35)
  Top 0.152: TL04CN-1.1 45.53,54.62 31.5,68.65 31.5,99.5 31,100 v30,100
  Bottom 0.152: TL04CN-1.1 47.73,54.12 R29.2 | R13.1 v30,100
N$32  (via drill 0.35)
  Top 0.152: TL04CN-1.6 47.5,43.39 v47.5,46
  Bottom 0.152: TL04CN-1.6 47.43,41.42 R32.1 | R31.2 49.5,50 47.5,50 v47.5,46
N$33
  Bottom 0.152: TR1.P$1_TIP 30,108.5 R13.2
N$34
  Bottom 0.152: TR2.P$1_TIP 39.99,108.5 40,108.5 R14.2
N$35
  Bottom 0.152: TL04CN-1.9 52.5,41.42 | 52.5,41.42 51.57,41.42 R33.2 | R34.1 56,48 52.5,48 52.5,41.42
N$36
  Bottom 0.152: TR3.P$1_TIP 49.99,108.5 50,108.5 R30.2
N$37  (via drill 0.35)
  Top 0.152: v50,100 48.5,98.5 48.5,84.5 45.5,81.5 45.5,79.4 47.52,77.39 47.52,73.98 45.5,71.97 45.5,59.5 51,54 51,50.5 54,50.5 54.44,50.06 54.44,38.88 TL04CN-1.8
  Bottom 0.152: TL04CN-1.8 51.27,38.88 R33.1 | R30.1 v50,100
N$38
  Bottom 0.152: R36.2 51.57,51.58 TL04CN-1.13 53.55,51.5 54.5,51.5 54.5,55.15 R35.1
N$39  (via drill 0.35)
  Top 0.152: v58.5,100 57,98.5 50,98.5 49,97.5 49,84.5 50,84.5 50,57.59 TL04CN-1.14
  Bottom 0.152: TL04CN-1.14 51.27,54.12 R36.1 | R15.1 58.5,102.65 v58.5,100
N$40
  Bottom 0.152: TR4.P$1_TIP 58,108.5 R15.2
OLEDCLK
  Bottom 0.152: SSD1306-128X64.3 28.41,81.16 28.41,33.75 22.38,27.72 U$1.13/SCK
OLEDCS
  Bottom 0.152: SSD1306-128X64.7 37.56,82.06 33,77.5 33,41.74 37.5,41.74 37.5,33 35.81,33 U$1.10/CS
OLEDDATA
  Bottom 0.152: SSD1306-128X64.4 29.95,35.93 U$1.11/MOSI
OLEDDC
  Bottom 0.152: SSD1306-128X64.6 32.02,79.16 32.02,63.02 32,63 32,39 37,39 37,35.5 35.77,35.5 U$1.9/CS
OLEDRST
  Bottom 0.152: SSD1306-128X64.5 30.98,80.66 30.98,37.38 35.12,37.38 U$1.8
TRLSCL
  Bottom 0.152: U$4.SCL 3.04,33.07 10.98,33.07 20.38,42.46 U$1.19/A5/SCL
TRLSDA  (via drill 0.35)
  Top 0.152: U$4.SDA 2.65,35 8.5,35 v8.5,31
  Bottom 0.152: U$1.18/A4/SDA 19.88,40.42 10.46,31 v8.5,31
VCC  (via drill 0.35)  (1 unrouted)
  Top 0.152: v50,6 52.5,6 52.5,26 51.5,27 v51.5,43
  Bottom 0.152: U$2.IN D1.C 18.23,22.27 19.13,21.37 29,21.37 29,6.22 49.78,6.22 v50,6 | v51.5,43 48.5,43 45.53,45.97 TL04CN-1.4 | v52,26.5 TL04CN-2.4
VSS
  Bottom 0.152: D2.A 54.59,12.08 54.54,12.12 54.54,16 57.92,19.37 57.92,26.5 | TL04CN-2.11 57.92,26.5 | 57.92,26.5 57.92,40.58 54.5,44 54.5,46.47 54.47,46.5 TL04CN-1.11